# Altium project Back_Expansion_Base.PrjPcb
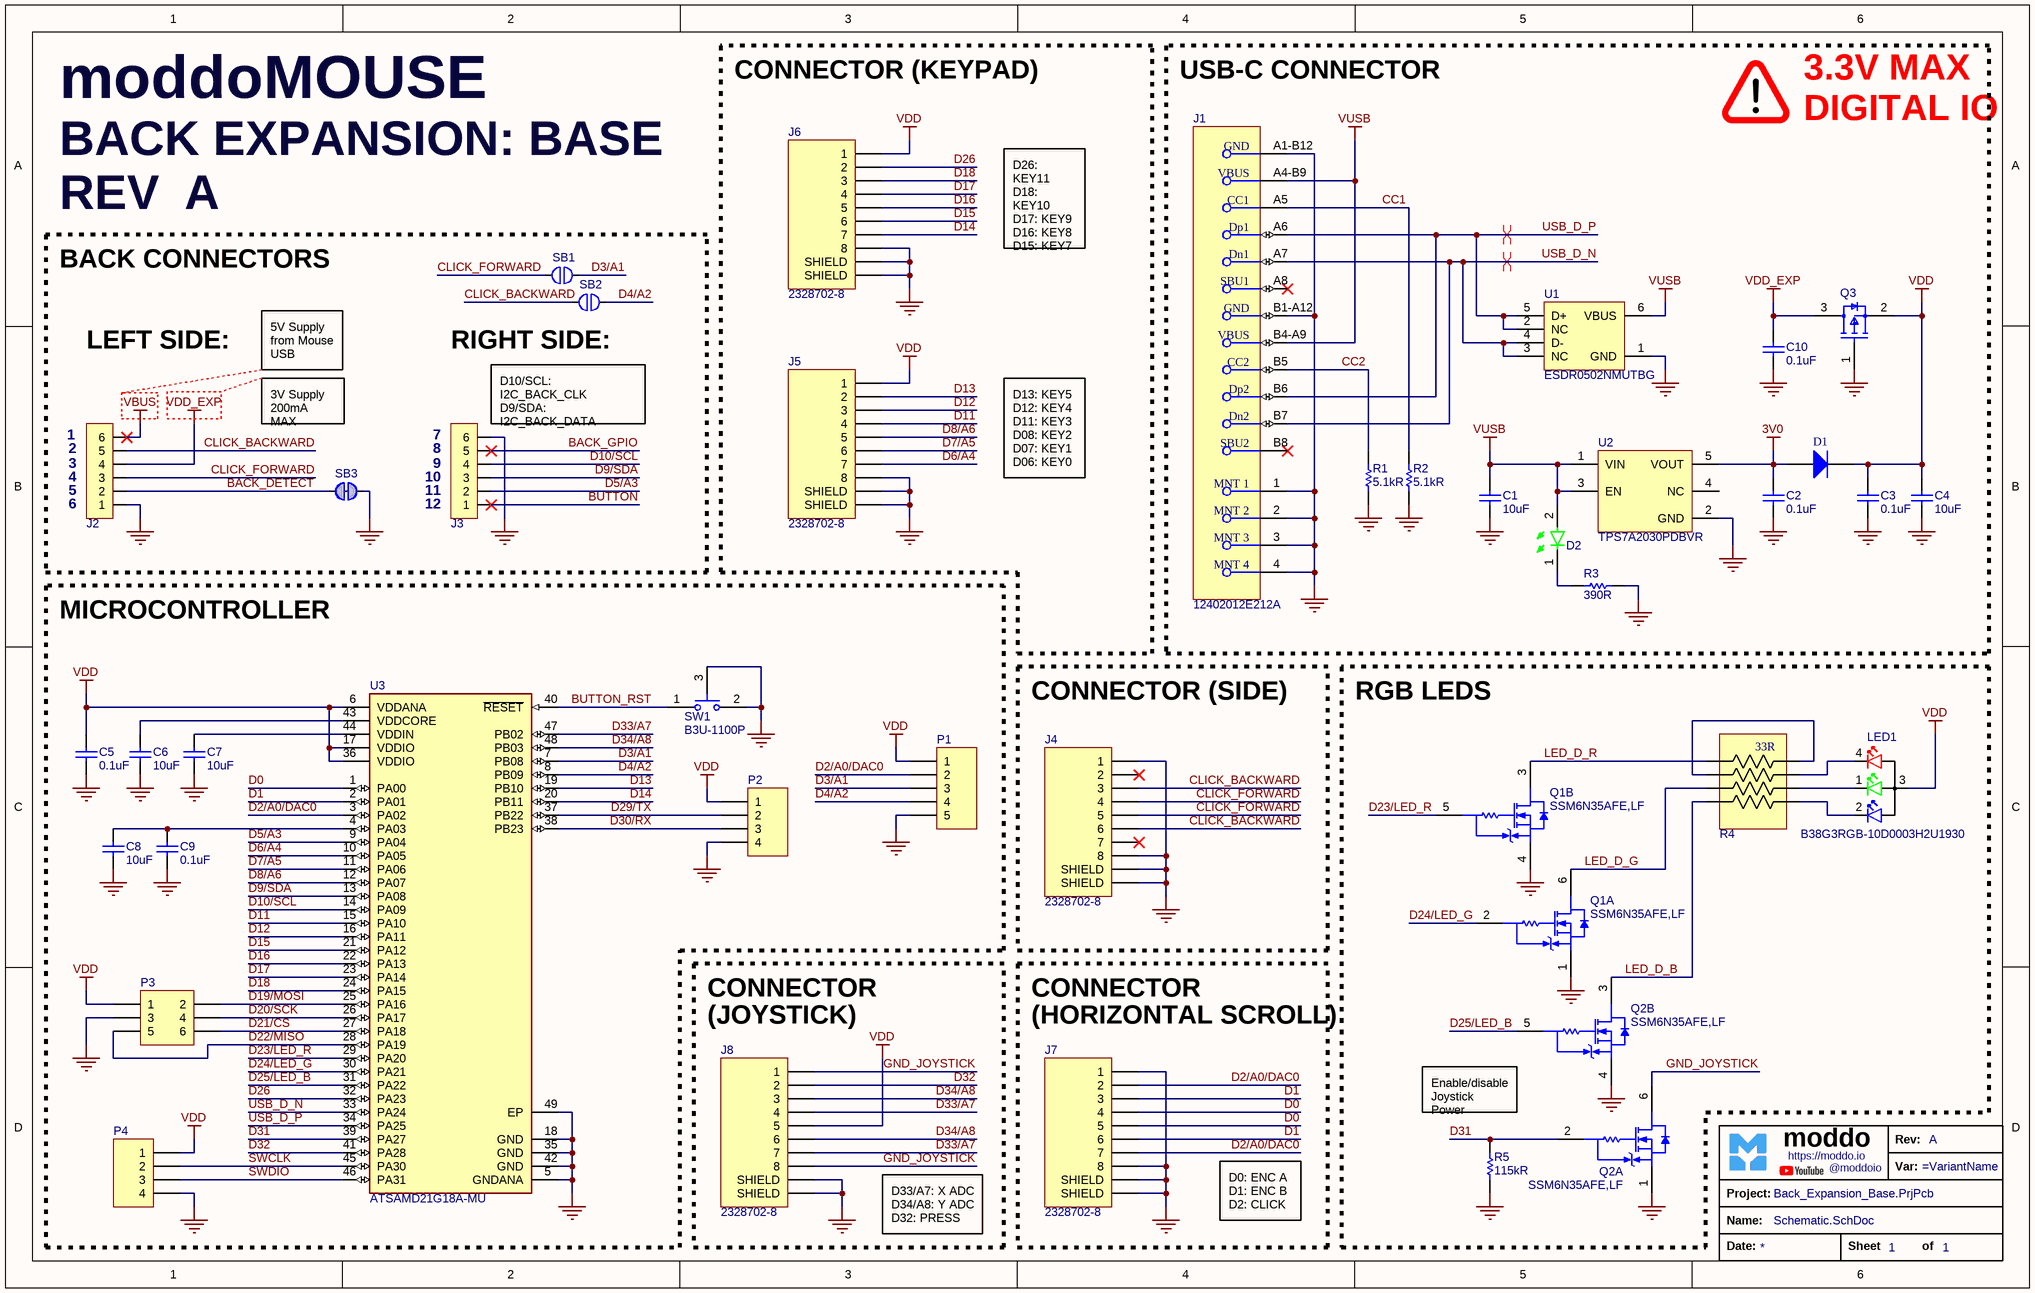
[diagram p0: Schematic.SchDoc]
Revision: A
1 sheet, 41 parts. Net scope: global (net labels, ports and power ports of the same name join across sheets).
Board files: PCB.PcbDoc, PcbPanel.PcbDoc

## Sheet Schematic.SchDoc
size B; SheetNumber: 1; SheetTotal: 1

### Parts
?  TitleBlock_moddo  (value not drawn)  (graphical)
C1  10uF  [C0603]
C2  0.1uF  [C0402]
C3  0.1uF  [C0402]
C4  10uF  [C0603]
C5  0.1uF  [C0402]
C6  10uF  [C0603]
C7  10uF  [C0603]
C8  10uF  [C0603]
C9  0.1uF  [C0402]
C10  0.1uF  [C0402]
D1  MMDL770T1G  [ONSC-SOD-323-2-477-02_V]  (value not drawn)
D2  LTST-C191KGKT  [LED0603_G]  (value not drawn)
J1  12402012E212A  [12402012E212A]
J2  1271WR-6P  [1.27mm_6pins_MaleHeader_RightAngle]  (value not drawn)
J3  1271WR-6P  [1.27mm_6pins_MaleHeader_RightAngle]  (value not drawn)
J4  2328702-8  [2328702-8]
J5  2328702-8  [2328702-8]
J6  2328702-8  [2328702-8]
J7  2328702-8  [2328702-8]
J8  2328702-8  [2328702-8]
LED1  B38G3RGB-10D0003H2U1930  [B38G3RGB-10D0003H2U1930]
P1  Header 5  [HDR1X5]  (value not drawn)
P2  Header 4  [HDR1X4]  (value not drawn)
P3  Header 3X2  [HDR2X3]  (value not drawn)
P4  Header 4  [HDR1X4]  (value not drawn)
Q1  SSM6N35AFE,LF  [SSM6N35AFE,LF]  (parts A,B of 2)
Q2  SSM6N35AFE,LF  [SSM6N35AFE,LF]  (parts A,B of 2)
Q3  IRLML6402TRPBF  [IRLML6402TRPBF]  (value not drawn)
R1  5.1kR  [R0402]
R2  5.1kR  [R0402]
R3  390R  [R1206]
R4  33R  [YC164-JR-0733RL]  (value not drawn)
R5  115kR  [R0402]
SB1  Solderbridge  [Solderbridge]  (value not drawn)  (no BOM)
SB2  Solderbridge  [Solderbridge]  (value not drawn)  (no BOM)
SB3  Solderbridge  [Solderbridge_Shorted]  (value not drawn)  (net tie, no BOM)
SW1  B3U-1100P  [FP-B3U-1100P-MFG]
U1  ESDR0502NMUTBG  [ESDR0502NMUTBG]
U2  TPS7A2030PDBVR  [TPS7A2030PDBVR]
U3  ATSAMD21G18A-MU  [FP-C04-21493-MFG]

### Blocks framed on the sheet
CONNECTOR (KEYPAD): J5 J6
REV: J2 J3 SB1-SB3
MICROCONTROLLER: C5-C9 P1-P4 SW1 U3
CONNECTOR (SIDE): J4
RGB LEDS: LED1 Q1 Q2 R4 R5

### Nets
3V0: C2.2 D1.2(A) U2.5(VOUT)
GND: C1.2 C2.1 C3.1 C4.2 C5.1 C6.2 C7.2 C8.2 C9.1 C10.1 J1.1(MNT_1) J1.2(MNT_2) J1.3(MNT_3) J1.4(MNT_4) J1.A1-B12(GND) J1.B1-A12(GND) J2.1 J3.6 J4.1 J4.8 J4.S1(SHIELD) J4.S2(SHIELD) J5.8 J5.S1(SHIELD) J5.S2(SHIELD) J6.8 J6.S1(SHIELD) J6.S2(SHIELD) J7.1 J7.8 J7.S1(SHIELD) J7.S2(SHIELD) J8.S1(SHIELD) J8.S2(SHIELD) P1.5 P2.4 P3.3 P4.4 Q1.1(S) Q1.4(S) Q2.1(S) Q2.4(S) Q3.1(G) R1.1 R2.1 R3.1 R5.2 SB3.1 SW1.2 SW1.3 U1.1(GND) U2.2(GND) U3.5(GNDANA) U3.18(GND) U3.35(GND) U3.42(GND) U3.49(EP)
VBUS: J2.6
VDD: C3.2 C4.1 C5.2 D1.1(K) J5.1 J6.1 J8.5 LED1.3(C) P1.1 P2.1 P3.1 P4.1 Q3.2(S) U3.6(VDDANA) U3.17(VDDIO) U3.36(VDDIO)
VDD_EXP: C10.2 J2.4 Q3.3(D)
VUSB: C1.1 D2.2(A) J1.A4-B9(VBUS) J1.B4-A9(VBUS) U1.6(VBUS) U2.1(VIN) U2.3(EN)
BACK_DETECT: J2.2 SB3.2
BACK_GPIO: J3.5
BUTTON: J3.1
BUTTON_RST: SW1.1 U3.40(~{RESET})
CC1: J1.A5(CC1) R2.2
CC2: J1.B5(CC2) R1.2
CLICK_BACKWARD: J2.5 J4.3 J4.6 SB2.2
CLICK_FORWARD: J2.3 J4.4 J4.5 SB1.2
D0: J7.4 J7.5 U3.1(PA00)
D1: J7.3 J7.6 U3.2(PA01)
D2/A0/DAC0: J7.2 J7.7 P1.2 U3.3(PA02)
D3/A1: P1.3 SB1.1 U3.7(PB08)
D4/A2: P1.4 SB2.1 U3.8(PB09)
D5/A3: J3.2 U3.9(PA04)
D6/A4: J5.7 U3.10(PA05)
D7/A5: J5.6 U3.11(PA06)
D8/A6: J5.5 U3.12(PA07)
D9/SDA: J3.3 U3.13(PA08)
D10/SCL: J3.4 U3.14(PA09)
D11: J5.4 U3.15(PA10)
D12: J5.3 U3.16(PA11)
D13: J5.2 U3.19(PB10)
D14: J6.7 U3.20(PB11)
D15: J6.6 U3.21(PA12)
D16: J6.5 U3.22(PA13)
D17: J6.4 U3.23(PA14)
D18: J6.3 U3.24(PA15)
D19/MOSI: P3.2 U3.25(PA16)
D20/SCK: P3.4 U3.26(PA17)
D21/CS: P3.6 U3.27(PA18)
D22/MISO: P3.5 U3.28(PA19)
D23/LED_R: Q1.5(G) U3.29(PA20)
D24/LED_G: Q1.2(G) U3.30(PA21)
D25/LED_B: Q2.5(G) U3.31(PA22)
D26: J6.2 U3.32(PA23)
D29/TX: P2.2 U3.37(PB22)
D30/RX: P2.3 U3.38(PB23)
D31: Q2.2(G) R5.1 U3.39(PA27)
D32: J8.2 U3.41(PA28)
D33/A7: J8.4 J8.7 U3.47(PB02)
D34/A8: J8.3 J8.6 U3.48(PB03)
GND_JOYSTICK: J8.1 J8.8 Q2.6(D)
LED_D_B: Q2.3(D) R4.4
LED_D_G: Q1.6(D) R4.3
LED_D_R: Q1.3(D) R4.1
SWCLK: P4.2 U3.45(PA30)
SWDIO: P4.3 U3.46(PA31)
USB_D_N: J1.A7(Dn1) J1.B7(Dn2) U1.3(NC) U1.4(D-) U3.33(PA24)
USB_D_P: J1.A6(Dp1) J1.B6(Dp2) U1.2(NC) U1.5(D+) U3.34(PA25)
NetC6_1: C6.1 U3.43(VDDCORE)
NetC7_1: C7.1 U3.44(VDDIN)
NetC8_1: C8.1 C9.2 U3.4(PA03)
NetD2_1: D2.1(C) R3.2
NetLED1_1: LED1.1(G) R4.6
NetLED1_2: LED1.2(B) R4.5
NetLED1_4: LED1.4(R) R4.7
NetR4_2: R4.2 R4.8

Not connected (* = marked no-connect by the designer): J1 A8(SBU1)* B8(SBU2)*; J4 2* 7*; U2 4(NC)

### Layout directives
differential pair: USB_D_N, USB_D_P

### Notes on the sheet
- USB-C CONNECTOR
- 3.3V MAX
- moddoMOUSE <https://moddo.io/>
- BACK EXPANSION: BASE <https://moddo.io/>
- DIGITAL IO
- BACK CONNECTORS
- D26: KEY11
  D18: KEY10
  D17: KEY9
  D16: KEY8
  D15: KEY7
  D14: KEY6
- LEFT SIDE:
- 5V Supply
  from Mouse USB
- (near SB2) RIGHT SIDE:
- 3V Supply
  200mA MAX
- (near J3) D10/SCL: I2C_BACK_CLK
  D9/SDA: I2C_BACK_DATA
  D5/A3: BACK_INT
- (near J2) 1
- (near J2) 2
- (near J2) 3
- (near J2) 4
- (near J2) 5
- (near J3) 7
- (near J3) 8
- (near J3) 9
- (near J3) 10
- (near J3) 11
- D13: KEY5
  D12: KEY4
  D11: KEY3
  D08: KEY2
  D07: KEY1
  D06: KEY0
- (near J2) 6
- (near J3) 12
- CONNECTOR
- (near J8) (JOYSTICK)
- (near J7) (HORIZONTAL SCROLL)
- Enable/disable Joystick Power
- D33/A7: X ADC
  D34/A8: Y ADC
  D32: PRESS
- D0: ENC A
  D1: ENC B
  D2: CLICK
- (in symbol TitleBlock_moddo) Rev:; moddo; https://moddo.io; Var:; @moddoio; Project:; Name:; Date:; Sheet; of

### Library data of the parts
C1 C4 C6-C8 = GRM188R61E106KA73D: 25V 10uF X5R ±10% 0603 Multilayer Ceramic Capacitors MLCC - SMD/SMT ROHS; Manufacturer: Murata; Manufacturer Lifecycle Status: IN PRODUCTION; Value: 10µF; Capacitance: 10uF; Supplier: Newark; Supplier Part Number: 92AH5110; Manufacturer Part Number: GRM188R61E106KA73D; RoHS: Compliant; Category: Ceramic Capacitors; Stock: 108000; Pricing: 4000=0.064, 8000=0.06, 16000=0.06, 24000=0.059 (CAD); Case/Package: 0603; Dielectric: X5R; Dielectric Material: Ceramic; Height: 800µm; Length: 1.6mm; Lifecycle Status: Production; Material: Ceramic; Max Operating Temperature: 85°C; Min Operating Temperature: -55°C; Mounting Technology: Surface Mount; Number of Terminals: 2; REACH SVHC: Yes; Schedule B: 8532240020, 8532240020|8532240020|8532240020|8532240020|8532240020; Thickness: 800µm; Tolerance: 10%; Voltage Rating: 25V; Voltage Rating (DC): 25V; Width: 800µm; ComponentLink1URL: https://datasheet.octopart.com:443/GRM188R61E106KA73D-Murata-datasheet-149523249.pdf?src-supplier=Newark; ComponentLink1Description: https://datasheet.octopart.com:443/GRM188R61E106KA73D-Murata-datasheet-149523249.pdf?src-supplier=Newark; ComponentLink2URL: https://datasheet.octopart.com:443/GRM188R61E106KA73D-Murata-datasheet-165579666.pdf?src-supplier=TME; ComponentLink2Description: https://datasheet.octopart.com:443/GRM188R61E106KA73D-Murata-datasheet-165579666.pdf?src-supplier=TME; ComponentLink3URL: https://datasheet.octopart.com:443/GRM188R61E106KA73D-Murata-datasheet-141274968.pdf?src-supplier=Ciiva; ComponentLink3Description: https://datasheet.octopart.com:443/GRM188R61E106KA73D-Murata-datasheet-141274968.pdf?src-supplier=Ciiva; ComponentLink4URL: https://datasheet.octopart.com:443/GRM188R61E106KA73D-Murata-datasheet-140704821.pdf?src-supplier=Ciiva; ComponentLink4Description: https://datasheet.octopart.com:443/GRM188R61E106KA73D-Murata-datasheet-140704821.pdf?src-supplier=Ciiva; ComponentLink5URL: https://datasheet.octopart.com:443/GRM188R61E106KA73D-Murata-datasheet-138742889.pdf?src-supplier=Ciiva; ComponentLink5Description: https://datasheet.octopart.com:443/GRM188R61E106KA73D-Murata-datasheet-138742889.pdf?src-supplier=Ciiva; ComponentLink6URL: https://datasheet.octopart.com/GRM188R61E106KA73D-Murata-datasheet-12515295.pdf; ComponentLink6Description: https://datasheet.octopart.com/GRM188R61E106KA73D-Murata-datasheet-12515295.pdf; ComponentLink7URL: https://datasheet.octopart.com/GRM188R61E106KA73D-Murata-datasheet-12510076.pdf; ComponentLink7Description: https://datasheet.octopart.com/GRM188R61E106KA73D-Murata-datasheet-12510076.pdf; ComponentLink8URL: https://datasheet.octopart.com/GRM188R61E106KA73D-Murata-datasheet-11978611.pdf; ComponentLink8Description: https://datasheet.octopart.com/GRM188R61E106KA73D-Murata-datasheet-11978611.pdf; ComponentLink9URL: https://datasheet.octopart.com/GRM188R61E106KA73D-Murata-datasheet-10025737.pdf; ComponentLink9Description: https://datasheet.octopart.com/GRM188R61E106KA73D-Murata-datasheet-10025737.pdf; ComponentLink10URL: https://datasheet.octopart.com/GRM188R61E106KA73D-Murata-datasheet-8819587.pdf; ComponentLink10Description: https://datasheet.octopart.com/GRM188R61E106KA73D-Murata-datasheet-8819587.pdf; ComponentLink11URL: http://sigma.octopart.com:80/reach_statement/Murata-company-16.pdf?src-supplier=Compliance+Statements; ComponentLink11Description: http://sigma.octopart.com:80/reach_statement/Murata-company-16.pdf?src-supplier=Compliance+Statements
C2 C3 C5 C9 C10 = CL05B104KA5NNNC: 25V 100nF X7R ±10% 0402 Multilayer Ceramic Capacitors MLCC - SMD/SMT ROHS; Manufacturer: Samsung Electro-Mechanics; Supplier 1: DigiKey; Manufacturer Part Number: CL05B104KA5NNNC; RoHS: Compliant; Category: Ceramic Capacitors; Stock 1: 1082110; Pricing 1: 1=0.08, 10=0.004, 50=0.0036, 100=0.0032 (USD); Value: 0.1uF; Case/Package: 0402; Case Code (Imperial): 0402; Case Code (Metric): 1005; China RoHS: Compliant; Dielectric: X7R; Dielectric Material: Ceramic; Height: 500µm; Length: 1mm; Lifecycle Status: Production; Material: Ceramic; Max Operating Temperature: 125°C; Min Operating Temperature: -55°C; Mounting Technology: Surface Mount; Number of Terminals: 2; REACH SVHC: Yes; Schedule B: 8532240020, 8532240020|8532240020|8532240020|8532240020|8532240020|8532240020|8532240020|8532240020|8532240020|8532240020|8532240020|8532240020|8532240020|8532240020|8532240020|8532240020|8532240020|8532240020|8532240020|8532240020|8532240020|8532240020|8532240020|85; Thickness: 558.8µm; Tolerance: 10%; Voltage Rating: 25V; Voltage Rating (DC): 25V; Width: 500µm; ComponentLink1URL: https://datasheet.octopart.com:443/CL05B104KA5NNNC-Samsung-Electro-Mechanics-datasheet-136876160.pdf?src-supplier=Samsung+SCT; ComponentLink1Description: https://datasheet.octopart.com:443/CL05B104KA5NNNC-Samsung-Electro-Mechanics-datasheet-136876160.pdf?src-supplier=Samsung+SCT; ComponentLink2URL: https://datasheet.octopart.com:443/CL05B104KA5NNNC-Samsung-Electro-Mechanics-datasheet-116890910.pdf?src-supplier=Future+Electronics; ComponentLink2Description: https://datasheet.octopart.com:443/CL05B104KA5NNNC-Samsung-Electro-Mechanics-datasheet-116890910.pdf?src-supplier=Future+Electronics; ComponentLink3URL: https://datasheet.octopart.com:443/CL05B104KA5NNNC-Samsung-Electro-Mechanics-datasheet-104201047.pdf?src-supplier=Future+Electronics; ComponentLink3Description: https://datasheet.octopart.com:443/CL05B104KA5NNNC-Samsung-Electro-Mechanics-datasheet-104201047.pdf?src-supplier=Future+Electronics; ComponentLink4URL: https://datasheet.octopart.com:443/CL05B104KA5NNNC-Samsung-Electro-Mechanics-datasheet-148801811.pdf?src-supplier=Future+Electronics; ComponentLink4Description: https://datasheet.octopart.com:443/CL05B104KA5NNNC-Samsung-Electro-Mechanics-datasheet-148801811.pdf?src-supplier=Future+Electronics; ComponentLink5URL: https://datasheet.octopart.com/CL05B104KA5NNNC-Samsung-Electro-Mechanics-datasheet-97040617.pdf; ComponentLink5Description: https://datasheet.octopart.com/CL05B104KA5NNNC-Samsung-Electro-Mechanics-datasheet-97040617.pdf; ComponentLink6URL: https://datasheet.octopart.com/CL05B104KA5NNNC-Samsung-Electro-Mechanics-datasheet-8324245.pdf; ComponentLink6Description: https://datasheet.octopart.com/CL05B104KA5NNNC-Samsung-Electro-Mechanics-datasheet-8324245.pdf; ComponentLink7URL: https://datasheet.octopart.com:443/CL05B104KA5NNNC-Samsung-datasheet-8326407.pdf?src-supplier=TME; ComponentLink7Description: https://datasheet.octopart.com:443/CL05B104KA5NNNC-Samsung-datasheet-8326407.pdf?src-supplier=TME; Supplier Part Number 1: 1276-6720-1-ND; Capacitance: 0.1uF
D1 = MMDL770T1G: Schottky Barrier Diode, 2-Pin SOD-323, Pb-Free, Tape and Reel; Manufacturer: On Semiconductor; Manufacturer Lifecycle Status: ACTIVE; Configuration: Single; Current Rating: 100mA; Forward Current: 10mA; Forward Voltage: 1V; Max Power Dissipation: 200mW; Max Repetitive Reverse Voltage (Vrrm): 70V; Max Reverse Leakage Current: 200nA; Number of Elements: 1; ComponentLink2URL: http://www.onsemi.cn/pub_link/Collateral/MMDL770T1-D.PDF; DatasheetVersion: Rev. 3; PartNumber: MMDL770T1G; ComponentLink3Description: Package Specification; ComponentLink2Description: Datasheet; Mounting Technology: Surface Mount; ComponentLink1Description: Manufacturer URL; PackageDescription: 2-Pin SOD, Body 1.7 x 1.25 mm; ComponentLink3URL: http://www.onsemi.com/pub_link/Collateral/477-02.PDF.1; PackageReference: SOD-323-2-477-02; ComponentLink1URL: http://www.onsemi.com/; RoHS: TRUE; Packing: Tape and Reel; PackageVersion: Rev. H, 03/2007; Supplier: Avnet; Supplier Part Number: 26K4556; Manufacturer Part Number: MMDL770T1G; Category: Schottky Diodes; Stock: 5789; Pricing: 1=0.11, 25=0.054, 50=0.051, 100=0.047 (USD); Case/Package: SOD-323-2; China RoHS: Compliant; Country of Origin: Mainland China; Export Control Classification Number (ECCN) Code: EAR99; Element Configuration: Single; Height: 1mm; Harmonized Tariff Schedule (HTS) Code: 8541.10.00.60; Introduction Date: 2000-01-01; Lead Free: Lead Free; Length: 1.8mm; Lifecycle Status: Production; Max Operating Temperature: 150°C; Max Reverse Voltage (DC): 70V; Min Operating Temperature: -55°C; Pins: 2; Number of Terminals: 2; Output Current: 100mA; Packaging: Tape and Reel; Peak Reverse Current: 200nA; Power Dissipation: 200mW; Radiation Hardening: No; REACH SVHC: Yes; Reverse Standoff Voltage: 70V; Schedule B: 8541100050, 8541100050|8541100050, 8541100050|8541100050|8541100050, 8541100050|8541100050|8541100050|8541100050; Voltage Rating (DC): 70V; Width: 1.35mm; ComponentLink4URL: https://datasheet.octopart.com:443/MMDL770T1G-onsemi-datasheet-180963709.pdf?src-supplier=IHS; ComponentLink4Description: https://datasheet.octopart.com:443/MMDL770T1G-onsemi-datasheet-180963709.pdf?src-supplier=IHS; ComponentLink5URL: https://datasheet.octopart.com:443/MMDL770T1G-ON-Semiconductor-datasheet-36854408.pdf?src-supplier=element14+APAC; ComponentLink5Description: https://datasheet.octopart.com:443/MMDL770T1G-ON-Semiconductor-datasheet-36854408.pdf?src-supplier=element14+APAC; ComponentLink6URL: https://datasheet.octopart.com:443/MMDL770T1G-ON-Semiconductor-datasheet-5319181.pdf?src-supplier=onsemi; ComponentLink6Description: https://datasheet.octopart.com:443/MMDL770T1G-ON-Semiconductor-datasheet-5319181.pdf?src-supplier=onsemi; ComponentLink7URL: https://datasheet.octopart.com:443/MMDL770T1G-onsemi-datasheet-182017838.pdf?src-supplier=Farnell; ComponentLink7Description: https://datasheet.octopart.com:443/MMDL770T1G-onsemi-datasheet-182017838.pdf?src-supplier=Farnell; ComponentLink8URL: https://datasheet.octopart.com:443/MMDL770T1G-onsemi-datasheet-12512631.pdf?src-supplier=Electro+Sonic; ComponentLink8Description: https://datasheet.octopart.com:443/MMDL770T1G-onsemi-datasheet-12512631.pdf?src-supplier=Electro+Sonic; ComponentLink9URL: https://datasheet.octopart.com:443/MMDL770T1G-ON-Semiconductor-datasheet-14055236.pdf?src-supplier=iiiC; ComponentLink9Description: https://datasheet.octopart.com:443/MMDL770T1G-ON-Semiconductor-datasheet-14055236.pdf?src-supplier=iiiC; ComponentLink10URL: http://sigma.octopart.com:80/150618769/rohs_statement/ON-Semiconductor-MMDL770T1G.pdf?src-supplier=Compliance+Statements; ComponentLink10Description: http://sigma.octopart.com:80/150618769/rohs_statement/ON-Semiconductor-MMDL770T1G.pdf?src-supplier=Compliance+Statements; ComponentLink11URL: http://sigma.octopart.com:80/reach_statement/ON-Semiconductor-company-79.pdf?src-supplier=Compliance+Statements; ComponentLink11Description: http://sigma.octopart.com:80/reach_statement/ON-Semiconductor-company-79.pdf?src-supplier=Compliance+Statements; ComponentLink12URL: https://octopart.com:443/opatz8j6/c1?t=rGUbnPQX5GDmqEoGA-uR9SMXeEE7gORXoUpQk9tSLLSbDH3jegWqyoKxn1aLDysZ9F5UsAZS4pPStALKuwhJs2fCT0RUcZefN4YW3NRJTnKxS4A-_hdC7myPNVw6LMAUwIC-S9tezZfVA4A1ydwTwICm1Zig62LOizv3-I4cESK-S3z73XMi6jENgAwvT9WW2Ujns6vlfkFPR1ge60eOsdw7mCv_eawZuRnDiCvhTwxevApDMfItvTsY4qOoFIyWXnC3xRoUEF-kP7l_SrDrtqPP9kRW2I59JGoGtbuF7U1X9Kz7fF6DLUUU8OKOHaq00oGLbmB3QQR_ilBlaPwbBtyCq9UFUCFQV3Lx&src-supplier=Compliance+Statements; ComponentLink12Description: https://octopart.com:443/opatz8j6/c1?t=rGUbnPQX5GDmqEoGA-uR9SMXeEE7gORXoUpQk9tSLLSbDH3jegWqyoKxn1aLDysZ9F5UsAZS4pPStALKuwhJs2fCT0RUcZefN4YW3NRJTnKxS4A-_hdC7myPNVw6LMAUwIC-S9tezZfVA4A1ydwTwICm1Zig62LOizv3-I4cESK-S3z73XMi6jENgAwvT9WW2Ujns6vlfkFPR1ge60eOsdw7mCv_eawZuRnDiCvhTwxevApDMfItvTsY4qOoFIyWXnC3xRoUEF-kP7l_SrDrtqPP9kRW2I59JGoGtbuF7U1X9Kz7fF6DLUUU8OKOHaq00oGLbmB3QQR_ilBlaPwbBtyCq9UFUCFQV3Lx&src-supplier=Compliance+Statements; ComponentLink13URL: https://octopart.com:443/opatz8j6/c1?t=xWlJBbSOjuihLu5tuYbHtsOtU_1QEHMfXja7QzQLZunojekw5uNnIM6cdSsnrAiuel8TWOmyDr2oU2k5holZexZGehk33AL-VJp_F-YhdfFYCHMkiSGbs39G6IHVRAjVdbrrjoHKUeBgpuPxzOORf6r5STdjFqtSwLT9Nq4Bz44wz_CIS2ZBWUVn7GkwGD0qpIrqRgfjV-NMFfhaHRoet9F-4YHZTFqxnCOCPSqoXpX2X76YlNkd9rQHSxjoEhR65VTyaE62P0vZksiIy9_tvP3cuZ7OKmIIlGt_ji7T3rxylmYploIrt9FpCqpYCsF1M5B6QleRuxMliCf8adPp1S-NqaPXrK-rp0vGQA&src-supplier=Compliance+Statements; ComponentLink13Description: https://octopart.com:443/opatz8j6/c1?t=xWlJBbSOjuihLu5tuYbHtsOtU_1QEHMfXja7QzQLZunojekw5uNnIM6cdSsnrAiuel8TWOmyDr2oU2k5holZexZGehk33AL-VJp_F-YhdfFYCHMkiSGbs39G6IHVRAjVdbrrjoHKUeBgpuPxzOORf6r5STdjFqtSwLT9Nq4Bz44wz_CIS2ZBWUVn7GkwGD0qpIrqRgfjV-NMFfhaHRoet9F-4YHZTFqxnCOCPSqoXpX2X76YlNkd9rQHSxjoEhR65VTyaE62P0vZksiIy9_tvP3cuZ7OKmIIlGt_ji7T3rxylmYploIrt9FpCqpYCsF1M5B6QleRuxMliCf8adPp1S-NqaPXrK-rp0vGQA&src-supplier=Compliance+Statements
D2 = LTST-C191KGKT: Single Color LED, Ultra Bright Green, Water Clear, 1.1mm; Manufacturer: Lite-On; Dominant Wavelength: 571nm; Forward Current: 30mA; Forward Voltage: 2.4V; Lens Color: Clear, Colorless; Luminous Intensity: 18mcd; Number of Circuits: 1; Peak Wavelength: 574nm; Power Dissipation: 75mW; Reverse Voltage: 5V; Shape: Rectangular; Test Current: 20mA; Viewing Angle: 130°; Wavelength: 576.5nm; Supplier: DigiKey; Supplier Part Number: 160-1446-1-ND; Manufacturer Part Number: LTST-C191KGKT; RoHS: Compliant; Category: LEDs; Stock: 2683248; Pricing: 1=0.15, 10=0.1, 100=0.0688, 500=0.05448, 1000=0.04972, 2000=0.04564, 5000=0.04116, 10000=0.03835, 15000=0.0369, 25000=0.03527, 35000=0.03429, 50000=0.03334, 125000=0.03124, 250000=0.02993 (USD); Case/Package: 0603; Case Code (Imperial): 0603; Case Code (Metric): 1608; China RoHS: Compliant; Color: Green; Contact Plating: Tin; Depth: 800µm; Height: 550µm; Illumination Color: Green; Lead Free: Lead Free; Length: 1.6mm; Lens Style: Clear; Lens Transparency: Clear; Lifecycle Status: Production; Max Operating Temperature: 85°C; Min Operating Temperature: -55°C; Mounting Technology: Surface Mount; Number of Elements: 1; Number of LEDs: 1; Pins: 2; Number of Terminals: 2; Power Rating: 75mW; Radiation Hardening: No; REACH SVHC: Yes; Schedule B: 8541402000, 8541402000|8541402000|8541402000|8541402000|8541402000; Terminal Pitch: 1.5mm; Width: 800µm; ComponentLink1URL: https://datasheet.octopart.com:443/LTST-C191KGKT-Lite-On-datasheet-86397321.pdf?src-supplier=Electro+Sonic; ComponentLink1Description: https://datasheet.octopart.com:443/LTST-C191KGKT-Lite-On-datasheet-86397321.pdf?src-supplier=Electro+Sonic; ComponentLink2URL: https://datasheet.octopart.com:443/LTST-C191KGKT-Lite-On-datasheet-180605192.pdf?src-supplier=IHS; ComponentLink2Description: https://datasheet.octopart.com:443/LTST-C191KGKT-Lite-On-datasheet-180605192.pdf?src-supplier=IHS; ComponentLink3URL: https://datasheet.octopart.com:443/LTST-C191KGKT-Lite-On-datasheet-159358.pdf?src-supplier=_legacy+Avnet; ComponentLink3Description: https://datasheet.octopart.com:443/LTST-C191KGKT-Lite-On-datasheet-159358.pdf?src-supplier=_legacy+Avnet; ComponentLink4URL: https://datasheet.octopart.com:443/LTST-C191KGKT-Lite-On-datasheet-165573808.pdf?src-supplier=TME; ComponentLink4Description: https://datasheet.octopart.com:443/LTST-C191KGKT-Lite-On-datasheet-165573808.pdf?src-supplier=TME; ComponentLink5URL: https://datasheet.octopart.com:443/LTST-C191KGKT-Lite-On-datasheet-43775822.pdf?src-supplier=TME; ComponentLink5Description: https://datasheet.octopart.com:443/LTST-C191KGKT-Lite-On-datasheet-43775822.pdf?src-supplier=TME; ComponentLink6URL: https://datasheet.octopart.com:443/LTST-C191KGKT-Lite-On-datasheet-32047002.pdf?src-supplier=Future+Electronics; ComponentLink6Description: https://datasheet.octopart.com:443/LTST-C191KGKT-Lite-On-datasheet-32047002.pdf?src-supplier=Future+Electronics; ComponentLink7URL: https://datasheet.octopart.com:443/LTST-C191KGKT-Lite-On-datasheet-65361.pdf?src-supplier=DigiKey; ComponentLink7Description: https://datasheet.octopart.com:443/LTST-C191KGKT-Lite-On-datasheet-65361.pdf?src-supplier=DigiKey
J1 = 12402012E212A: USB Connector, USB Type C, USB 2.0, Receptacle, 24 Ways, Surface Mount, Through Hole Mount; Manufacturer: Amphenol; Contact Resistance: 40mΩ; Current Rating: 5A; Insulation Resistance: 100MΩ; Number of Ports: 1; Supplier 1: Newark; Manufacturer Part Number: 12402012E212A; RoHS: Compliant; Category: Connectors; Stock 1: 4800; Pricing 1: 800=0.723, 1600=0.716, 3200=0.702, 4800=0.686, 8000=0.675 (CAD); Contact Gender: Male; Lifecycle Status: Production; Pins: 24; Number of Rows: 1; REACH SVHC: Yes; Shell Finish: Nickel; Shell Material: Stainless Steel; Terminal Pitch: 500µm; ComponentLink1URL: https://datasheet.octopart.com:443/12402012E212A-Amphenol-Communications-Solutions-datasheet-182242347.pdf?src-supplier=IHS; ComponentLink1Description: https://datasheet.octopart.com:443/12402012E212A-Amphenol-Communications-Solutions-datasheet-182242347.pdf?src-supplier=IHS; Supplier Part Number 1: 29AK9975
J2 J3 = 1.27mm_6pins_male_rightangle: Pin Header 6 Position 1.27mm Pitch Single Row Through Hole, Right Angle -40℃~+105℃; Manufacturer: HanElectricity; Manufacturer Part Number: 1271WR-6P
J4-J8 = 2328702-8: FFC/FPC Connector, 8 Contact(s), 1 Row(s), Right Angle, Solder Terminal, Natural Insulator; Manufacturer: TE Connectivity; Actuator Material: Thermoplastic; Actuator Color: Black; Plating: Gold; Number of Positions: 8; Voltage Rating: 50V; Connector System: Wire-to-Board; Gender: Receptacle; Sealable: No (Without); Supplier 1: Arrow Electronics; Manufacturer Part Number: 2328702-8; RoHS: Yes; Category: FFC / FPC; Stock 1: 56000; Pricing 1: 28000=0.0961 (USD); Mounting Technology: Surface Mount; Contact Material: Copper Alloy; Contact Plating: Gold; Housing Material: Thermoplastic; Housing Color: Natural; Min Operating Temperature: -40°C; Max Operating Temperature: 85°C; Packaging: Cut Tape; Termination: Solder; Series: -; Number of Contacts: 8; Number of Rows: 1; Operating Supply Voltage: 50V; Orientation: Right Angle; Length: 6mm; Height: 1mm; Flammability Rating: UL94 V-0; ComponentLink1URL: https://www.te.com/commerce/DocumentDelivery/DDEController?Action=srchrtrv&amp;DocNm=2328702&amp;DocType=Customer+Drawing&amp;DocLang=English&src-supplier=Digikey; ComponentLink1Description: https://www.te.com/commerce/DocumentDelivery/DDEController?Action=srchrtrv&amp;DocNm=2328702&amp;DocType=Customer+Drawing&amp;DocLang=English&src-supplier=Digikey; Supplier Part Number 1: 2328702-8
LED1 = B38G3RGB-10D0003H2U1930: Led Rgb Mixed White ( 1.6(L)X1.6; Manufacturer: Inolux; Supplier 1: Arrow Electronics; Manufacturer Part Number: B38G3RGB-10D0003H2U1930; RoHS: No; Supplier Part Number 1: B38G3RGB-10D0003H2U1930
P1 = Header 5: Header, 5-Pin; LatestRevisionDate: 17-Jul-2002; LatestRevisionNote: Re-released for DXP Platform.; Publisher: Altium Limited; Manufacturer: N/A; Manufacturer Part Number: N/A
P2 P4 = Header 4: Header, 4-Pin; LatestRevisionDate: 17-Jul-2002; LatestRevisionNote: Re-released for DXP Platform.; Publisher: Altium Limited; Manufacturer: N/A; Manufacturer Part Number: N/A
P3 = Header 3X2: Header, 3-Pin, Dual row; LatestRevisionDate: 17-Jul-2002; LatestRevisionNote: Re-released for DXP Platform.; Publisher: Altium Limited; Manufacturer: N/A; Manufacturer Part Number: N/A
Q1 Q2 = SSM6N35AFE,LF: Small Low ON Resistance MOSFET Array Dual N-Channel 20V 250mA 6-Pin SOT-563 T/R; Manufacturer: Toshiba; Supplier 1: Mouser; Manufacturer Part Number: SSM6N35AFE,LF; RoHS: No; Category: MOSFETs; Stock 1: 156554; Pricing 1: 1=0.14, 10=0.08, 50=0.08, 100=0.067, 1000=0.058, 10000=0.045 (USD); ComponentLink1URL: https://toshiba.semicon-storage.com/info/docget.jsp?did=55422&prodName=SSM6N35AFE&src-supplier=Digikey; ComponentLink1Description: https://toshiba.semicon-storage.com/info/docget.jsp?did=55422&prodName=SSM6N35AFE&src-supplier=Digikey; Supplier Part Number 1: 757-SSM6N35AFELF
Q3 = IRLML6402TRPBF: MOSFET P-CH 20V 3.7A SOT-23; Manufacturer: Infineon; Reverse Recovery Time: 29ns; Max Forward Diode Voltage: -1.2V; Input Capacitace At Vds: 633pF @ -10V; Drain To Source Resistance: 0.05Ω; Gate To Source Voltage: 12V; Max Junction Temp: +150°C; Pulse Drain Current: -22A; Threshold Vgs Min: -0.4V; Turn Off Delay Time: 588ns; Number Of Channels: 1; Power Dissipation: 1.3W; Turn On Delay Time: 350ns; Drain To Source Breakdown Voltage: -20V; Continuous Drain Current: -3.7A; Depletion Mode: False; Gate Charge At Vgs: 8nC @ -5V; Rthja Max: 75°C/W; Threshold Vgs: -0.55V; Standoff Height: 0.01mm; Reverse Recovery Charge: 11nC; Device Class L2: Transistors; Ipc Land Pattern Name: SOT95P237X100-3; Temperature Range High: +150°C; Octopart: https://octopart.com/irlml6402trpbf-infineon-65874989; ComponentLink2URL: https://www.infineon.com/dgdl/irlml6402pbf.pdf?fileId=5546d462533600a401535668d5c2263c; Automotive: No; Manufacturer Part Number: IRLML6402TRPBF; Height: 1.12mm; Drain To Source Voltage: -20V; Digikey Description: MOSFET P-CH 20V 3.7A SOT-23; Device Class L1: Discrete Semiconductors; Package: Micro3; Lead Free: Yes; Temperature Range Low: -55°C; Number Of P Channels: 1; Technology: MOSFET; Temperature: -55°C to +150°C; Category: Trans; Footprint Url: http://irf.com/package/outline/po_micro3.pdf; RoHS: TRUE; Device Class L3: MOSFETs; Threshold Vgs Max: -1.2V; ComponentLink2Description: Datasheet
R1 R2 = RC0402FR-075K1L: 62.5mW Thick Film Resistors 50V ±100ppm/℃ ±1% 5.1kΩ 0402 Chip Resistor - Surface Mount ROHS; Manufacturer: Yageo Group; Max Power Dissipation: 63mW; Temperature Coefficient: 100ppm/°C; Resistance: 5.1kR; Supplier 1: Avnet; Manufacturer Part Number: RC0402FR-075K1L; RoHS: Compliant; Category: Chip SMD Resistors; Stock 1: 140000; Pricing 1: 10000=0.00097, 20000=0.00093, 40000=0.0009, 60000=0.00087, 80000=0.00084 (USD); Case/Package: 0402; Case Code (Imperial): 0402; China RoHS: Non-Compliant; Composition: Thick Film; Depth: 500µm; Features: Moisture Resistant; Height: 350µm; Lead Free: Lead Free; Length: 1mm; Lifecycle Status: Production; Max Operating Temperature: 155°C; Military Standard: Not; Min Operating Temperature: -55°C; Mounting Technology: Surface Mount; Pins: 2; Number of Terminals: 2; Number of Terminations: 2; Packaging: Cut Tape; Power Dissipation: 62.5mW; Power Rating: 63mW; REACH SVHC: Yes; Value: 5.1kΩ; Schedule B: 8533210045, 8533210045|8533210045, 8533210045|8533210045|8533210045, 8533210045|8533210045|8533210045|8533210045; Termination: SMD/SMT; Tolerance: 1%; Voltage Rating: 50V; Voltage Rating (DC): 50V; Width: 500µm; Working Voltage: 50V; ComponentLink1URL: https://datasheet.octopart.com:443/RC0402FR-075K1L-Yageo-datasheet-175887523.pdf?src-supplier=IHS; ComponentLink1Description: https://datasheet.octopart.com:443/RC0402FR-075K1L-Yageo-datasheet-175887523.pdf?src-supplier=IHS; ComponentLink2URL: https://datasheet.octopart.com:443/RC0402FR-075K1L-Yageo-datasheet-103092701.pdf?src-supplier=Upverter; ComponentLink2Description: https://datasheet.octopart.com:443/RC0402FR-075K1L-Yageo-datasheet-103092701.pdf?src-supplier=Upverter; ComponentLink3URL: https://datasheet.octopart.com:443/RC0402FR-075K1L-Yageo-datasheet-10408619.pdf?src-supplier=Newark; ComponentLink3Description: https://datasheet.octopart.com:443/RC0402FR-075K1L-Yageo-datasheet-10408619.pdf?src-supplier=Newark; ComponentLink4URL: https://datasheet.octopart.com:443/RC0402FR-075K1L-Yageo-datasheet-8324527.pdf?src-supplier=Newark; ComponentLink4Description: https://datasheet.octopart.com:443/RC0402FR-075K1L-Yageo-datasheet-8324527.pdf?src-supplier=Newark; ComponentLink5URL: https://datasheet.octopart.com:443/RC0402FR-075K1L-Yageo-datasheet-62067350.pdf?src-supplier=element14+APAC; ComponentLink5Description: https://datasheet.octopart.com:443/RC0402FR-075K1L-Yageo-datasheet-62067350.pdf?src-supplier=element14+APAC; ComponentLink6URL: https://datasheet.octopart.com:443/RC0402FR-075K1L-Yageo-datasheet-164759695.pdf?src-supplier=Future+Electronics; ComponentLink6Description: https://datasheet.octopart.com:443/RC0402FR-075K1L-Yageo-datasheet-164759695.pdf?src-supplier=Future+Electronics; ComponentLink7URL: https://datasheet.octopart.com:443/RC0402FR-075K1L-Yageo-datasheet-137700087.pdf?src-supplier=Future+Electronics; ComponentLink7Description: https://datasheet.octopart.com:443/RC0402FR-075K1L-Yageo-datasheet-137700087.pdf?src-supplier=Future+Electronics; ComponentLink8URL: https://datasheet.octopart.com:443/RC0402FR-075K1L-Yageo-datasheet-12531192.pdf?src-supplier=Future+Electronics; ComponentLink8Description: https://datasheet.octopart.com:443/RC0402FR-075K1L-Yageo-datasheet-12531192.pdf?src-supplier=Future+Electronics; ComponentLink9URL: https://datasheet.octopart.com:443/RC0402FR-075K1L-Yageo-datasheet-505231.pdf?src-supplier=Future+Electronics; ComponentLink9Description: https://datasheet.octopart.com:443/RC0402FR-075K1L-Yageo-datasheet-505231.pdf?src-supplier=Future+Electronics; ComponentLink10URL: https://datasheet.octopart.com:443/RC0402FR-075K1L-Yageo-datasheet-148775077.pdf?src-supplier=TME; ComponentLink10Description: https://datasheet.octopart.com:443/RC0402FR-075K1L-Yageo-datasheet-148775077.pdf?src-supplier=TME; ComponentLink11URL: https://datasheet.octopart.com/RC0402FR-075K1L-Yageo-datasheet-73766026.pdf; ComponentLink11Description: https://datasheet.octopart.com/RC0402FR-075K1L-Yageo-datasheet-73766026.pdf; ComponentLink12URL: https://datasheet.octopart.com:443/RC0402FR-075K1L-Yageo-datasheet-8329306.pdf?src-supplier=element14; ComponentLink12Description: https://datasheet.octopart.com:443/RC0402FR-075K1L-Yageo-datasheet-8329306.pdf?src-supplier=element14; ComponentLink13URL: http://sigma.octopart.com:80/rohs_statement/Yageo-company-2.pdf?src-supplier=Compliance+Statements; ComponentLink13Description: http://sigma.octopart.com:80/rohs_statement/Yageo-company-2.pdf?src-supplier=Compliance+Statements; ComponentLink14URL: http://sigma.octopart.com:80/conflict_mineral_statement/Yageo-company-3.pdf?src-supplier=Compliance+Statements; ComponentLink14Description: http://sigma.octopart.com:80/conflict_mineral_statement/Yageo-company-3.pdf?src-supplier=Compliance+Statements; Supplier Part Number 1: RC0402FR-075K1L
R3 = CRCW1206390RFKEAHP: Res Thick Film 1206 390 Ohm 1% 0.75W(3/4W) ±100ppm/°C Pad SMD Automotive T/R; Manufacturer: Vishay; Power Rating: 500mW; Voltage Rating: 200V; Supplier 1: Mouser; Manufacturer Part Number: CRCW1206390RFKEAHP; RoHS: Yes; Category: Chip SMD Resistors; Stock 1: 1207; Pricing 1: 1=0.32, 10=0.115, 50=0.115, 100=0.073, 1000=0.058, 10000=0.044 (USD); Case/Package: 1206; Case Code (Metric): 3216; Case Code (Imperial): 1206; Contact Plating: Tin; Min Operating Temperature: -55°C; Max Operating Temperature: 155°C; Package Quantity: 10; Resistance: 390R; Tolerance: 1%; Packaging: Cut Tape; Resistor Type: Thick Film; Number of Terminations: 2; Termination: SMD/SMT; Max Power Dissipation: 500mW; Temperature Coefficient: 100ppm/°C; Voltage Rating (DC): 200V; Features: Automotive AEC-Q200; Series: CRCW-HP; Resistance Tolerance: 1%; Technology: THICK FILM; Length: 0.122inch; Width: 0.063inch; Height: 0.026inch; Depth: 1.6mm; Lead Free: Lead Free; RoHS Compliant: Yes; Reach SVHC Compliant: Unknown; ComponentLink1URL: https://datasheet.ciiva.com/6546/crcwhpe3-6546213.pdf?src-supplier=Digikey; ComponentLink1Description: https://datasheet.ciiva.com/6546/crcwhpe3-6546213.pdf?src-supplier=Digikey; ComponentLink2URL: https://datasheet.ciiva.com/48524/crcwhpe3-48524826.pdf?src-supplier=Avnet; ComponentLink2Description: https://datasheet.ciiva.com/48524/crcwhpe3-48524826.pdf?src-supplier=Avnet; ComponentLink3URL: https://datasheet.ciiva.com/7673/1885357-7673082.pdf?src-supplier=Element14; ComponentLink3Description: https://datasheet.ciiva.com/7673/1885357-7673082.pdf?src-supplier=Element14; ComponentLink4URL: https://datasheet.ciiva.com/7673/1885357-7673081.pdf?src-supplier=Element14; ComponentLink4Description: https://datasheet.ciiva.com/7673/1885357-7673081.pdf?src-supplier=Element14; Supplier Part Number 1: 71-CRCW1206390RFKEAH
R4 = YC164-JR-0733RL: Res Thick Film Array 33 Ohm 5% 200ppm/ C ISOL Molded 8-Pin 1206(4 X 0603) Convex SMD Paper T/R; Manufacturer: Yageo; Number of Contacts: 8; Number of Circuits: 4; Voltage Rating: 50V; Circuit Type: Isolated; Power Per Element: 62.5mW; Temperature Coefficient: 200ppm/°C; Supplier 1: Future Electronics; Manufacturer Part Number: YC164-JR-0733RL; RoHS: Yes; Category: Resistor Arrays; Stock 1: 105000; Pricing 1: 5000=0.0064, 15000=0.0062, 25000=0.0061, 50000=0.006, 100000=0.0058 (USD); Mounting Technology: Surface Mount; Case/Package: 0603; Pins: 8; Case Code (Metric): 3216; Case Code (Imperial): 1206; Min Operating Temperature: -55°C; Max Operating Temperature: 155°C; Value: 33R; Tolerance: 5%; Packaging: Cut Tape; Number of Elements: 4; Package Quantity: 1; Number of Resistors: 4; Power Dissipation: 62.5mW; Working Voltage: 50V; Series: YC164; Technology: THICK FILM; Resistance Tolerance: 5%; Length: 0.126inch; Width: 0.063inch; Height: 0.028inch; Lead Free: Lead Free; Reach SVHC Compliant: Unknown; RoHS Compliant: Yes; ComponentLink1URL: https://datasheet.ciiva.com/2688/pyu-yc-tc164-51-rohs-l-3-2688397.pdf?src-supplier=Digikey; ComponentLink1Description: https://datasheet.ciiva.com/2688/pyu-yc-tc164-51-rohs-l-3-2688397.pdf?src-supplier=Digikey; ComponentLink2URL: https://datasheet.ciiva.com/2688/pyu-yc-tc164-51-rohs-l-3-2688398.pdf?src-supplier=Digikey; ComponentLink2Description: https://datasheet.ciiva.com/2688/pyu-yc-tc164-51-rohs-l-3-2688398.pdf?src-supplier=Digikey; ComponentLink3URL: https://datasheet.ciiva.com/2688/pyu-yc-tc164-51-rohs-l-3-2688399.pdf?src-supplier=Digikey; ComponentLink3Description: https://datasheet.ciiva.com/2688/pyu-yc-tc164-51-rohs-l-3-2688399.pdf?src-supplier=Digikey; ComponentLink4URL: https://datasheet.ciiva.com/8320/pyu-yc-tc164-51-rohs-l-3-8320237.pdf?src-supplier=Avnet; ComponentLink4Description: https://datasheet.ciiva.com/8320/pyu-yc-tc164-51-rohs-l-3-8320237.pdf?src-supplier=Avnet; ComponentLink5URL: https://datasheet.ciiva.com/8018/443424-8018013.pdf?src-supplier=Element14; ComponentLink5Description: https://datasheet.ciiva.com/8018/443424-8018013.pdf?src-supplier=Element14; ComponentLink6URL: https://datasheet.ciiva.com/8018/443424-8018014.pdf?src-supplier=Element14; ComponentLink6Description: https://datasheet.ciiva.com/8018/443424-8018014.pdf?src-supplier=Element14; Supplier Part Number 1: 1128537; Resistance: 33R
R5 = RC0402FR-07115KL: 62.5mW Thick Film Resistors 50V ±100ppm/℃ ±1% 115kΩ 0402 Chip Resistor - Surface Mount ROHS; Manufacturer: Yageo Group; Max Power Dissipation: 63mW; Temperature Coefficient: 100ppm/°C; Resistance: 115kR; Supplier 1: Avnet; Manufacturer Part Number: RC0402FR-07115KL; RoHS: Compliant; Category: Chip SMD Resistors; Stock 1: 4067; Pricing 1: 1=0.104, 25=0.009, 100=0.005, 500=0.004 (USD); Case/Package: 0402; Case Code (Imperial): 0402; Case Code (Metric): 1005; China RoHS: Non-Compliant; Composition: Thick Film; Contact Plating: Tin; Depth: 500µm; Features: Moisture Resistant; Height: 350µm; Lead Free: Lead Free; Length: 1mm; Lifecycle Status: Production; Max Operating Temperature: 155°C; Military Standard: Not; Min Operating Temperature: -55°C; Mounting Technology: Surface Mount; Number of Terminals: 2; Number of Terminations: 2; Power Dissipation: 62.5mW; Power Rating: 63mW; REACH SVHC: Yes; Value: 115kΩ; Schedule B: 8533210045, 8533210045|8533210045|8533210045|8533210045|8533210045; Termination: SMD/SMT; Tolerance: 1%; Voltage Rating: 50V; Voltage Rating (DC): 50V; Width: 500µm; Working Voltage: 50V; ComponentLink1URL: https://datasheet.octopart.com:443/RC0402FR-07115KL-Yageo-datasheet-175887523.pdf?src-supplier=Newark; ComponentLink1Description: https://datasheet.octopart.com:443/RC0402FR-07115KL-Yageo-datasheet-175887523.pdf?src-supplier=Newark; ComponentLink2URL: https://datasheet.octopart.com:443/RC0402FR-07115KL-Yageo-datasheet-103092701.pdf?src-supplier=Upverter; ComponentLink2Description: https://datasheet.octopart.com:443/RC0402FR-07115KL-Yageo-datasheet-103092701.pdf?src-supplier=Upverter; ComponentLink3URL: https://datasheet.octopart.com:443/RC0402FR-07115KL-Yageo-datasheet-10408619.pdf?src-supplier=_legacy+Avnet; ComponentLink3Description: https://datasheet.octopart.com:443/RC0402FR-07115KL-Yageo-datasheet-10408619.pdf?src-supplier=_legacy+Avnet; ComponentLink4URL: https://datasheet.octopart.com:443/RC0402FR-07115KL-Yageo-datasheet-164759695.pdf?src-supplier=Future+Electronics; ComponentLink4Description: https://datasheet.octopart.com:443/RC0402FR-07115KL-Yageo-datasheet-164759695.pdf?src-supplier=Future+Electronics; ComponentLink5URL: https://datasheet.octopart.com:443/RC0402FR-07115KL-Yageo-datasheet-137700087.pdf?src-supplier=Future+Electronics; ComponentLink5Description: https://datasheet.octopart.com:443/RC0402FR-07115KL-Yageo-datasheet-137700087.pdf?src-supplier=Future+Electronics; ComponentLink6URL: https://datasheet.octopart.com:443/RC0402FR-07115KL-Yageo-datasheet-12531192.pdf?src-supplier=Future+Electronics; ComponentLink6Description: https://datasheet.octopart.com:443/RC0402FR-07115KL-Yageo-datasheet-12531192.pdf?src-supplier=Future+Electronics; ComponentLink7URL: https://datasheet.octopart.com/RC0402FR-07115KL-Yageo-datasheet-73766026.pdf; ComponentLink7Description: https://datasheet.octopart.com/RC0402FR-07115KL-Yageo-datasheet-73766026.pdf; ComponentLink8URL: http://sigma.octopart.com:80/rohs_statement/Yageo-company-2.pdf?src-supplier=Compliance+Statements; ComponentLink8Description: http://sigma.octopart.com:80/rohs_statement/Yageo-company-2.pdf?src-supplier=Compliance+Statements; ComponentLink9URL: http://sigma.octopart.com:80/conflict_mineral_statement/Yageo-company-3.pdf?src-supplier=Compliance+Statements; ComponentLink9Description: http://sigma.octopart.com:80/conflict_mineral_statement/Yageo-company-3.pdf?src-supplier=Compliance+Statements; Supplier Part Number 1: 49AK1243
SB1 SB2 = SOLDERBRIDGE: Artikkelnr Noca: N.A.; Part Number: Solderbridge; Manufacturer: *; Manufacturer Part Number: *; Datasheet: *; LatestRevisionDate: 2009-12-14; Pin Count: 2; Publisher: Nordic Semiconductor; Published: 2009-12-14; Value: Solderbridge; Note: *; Supplier: *; Supplier part number: *; 2nd source Supplier: *; 2nd source part number: *; Footprint Doc: Solderbridge; Artikkelnr Simpro: N.A.
SB3 = SOLDERBRIDGE_SHORTED: Shorted Solderbridge; Part Number: Solderbridge Shorted; Artikkelnr Noca: N.A.; Manufacturer: *; Manufacturer Part Number: *; Datasheet: *; LatestRevisionDate: 2012-08-07; Pin Count: 2; Publisher: Nordic Semiconductor; Published: 2012-08-07; Value: Solderbridge; Note: *; Supplier: *; Supplier part number: *; 2nd source Supplier: *; 2nd source part number: *; Footprint Doc: Solderbridge_Shorted; Artikkelnr Simpro: N.A.
SW1 = B3U-1100P: SWITCH TACTILE SPST-NO 0.05A 12V; Manufacturer: Omron Electronics Inc-EMC Div; Switch Function: Off-Mom; Operating Force: 1.5N; Mechanical Life: 200000Cycles; Max Current Rating: 50mA; Illumination Type: Non-Illuminated; Actuator Type: Standard; Throw Configuration: SPST; Switch Travel: 0.15mm; Contact Resistance: 100mR; Actuator Length: 0.4mm; Ratings: Dust Proof; Termination: SMD/SMT; Packaging: Tape and Reel; Contact Plating: Silver; Max Operating Temperature: 70°C; Current Rating: 50mA; Electrical Life: 200000Cycles; Voltage Rating (DC): 12V; Length: 3.15mm; Weight: 0.022g; Min Operating Temperature: -25°C; Orientation: Straight; Contact Current Rating: 50mA; Package Quantity: 1; Max Voltage Rating (DC): 12V; Depth: 4mm; Lead Free: Lead Free; Mount: Surface Mount; Manufacturer Part Number: B3U-1100P
U1 = ESDR0502NMUTBG: Ultra Low Capacitance ESD Protection Array for High Speed Data Line Protection, 6-Pin UDFN, Pb-Free, Tape and Reel; Manufacturer: On Semiconductor; PPK Max (W): 100; C Max (pF): 0.6; V(BR) Min (V): 6; Direction: Unidirectional; IR Max (uA): 1; Number of Lines: 4; VRWM Max (V): 5.5; ComponentLink3Description: Package Specification; PartNumber: ESDR0502NMUTBG; PackageVersion: Rev. D, 09/2010; ComponentLink1URL: http://www.onsemi.com/; ComponentLink1Description: Manufacturer URL; DatasheetVersion: Rev. 4; Packing: Tape and Reel; PackageDescription: 6-Pin Small Outline No-Lead, Body 1.2 x 1 mm, Pitch 0.4 mm; RoHS: Pb-Free; ComponentLink3URL: http://www.onsemi.com/pub_link/Collateral/517AA.PDF; Mounting Technology: Surface Mount; PackageReference: UDFN-6-517AA-01; ComponentLink2Description: Datasheet; ComponentLink2URL: http://www.onsemi.cn/pub_link/Collateral/ESDR0502N-D.PDF; Manufacturer Part Number: ESDR0502NMUTBG
U2 = TPS7A2030PDBVR: 300-mA, ultra-low-noise, low-IQ, low-dropout (LDO) linear regulator with high PSRR 5-SOT-23 -40 to 125; Manufacturer: Texas Instruments; Supplier 1: Mouser; Manufacturer Part Number: TPS7A2030PDBVR; RoHS: Yes; Category: Voltage Regulators - Linear; Stock 1: 22538; Pricing 1: 1=0.49000, 10=0.41800, 50=0.41800, 100=0.29000, 1000=0.19000, 10000=0.15200 (USD); RoHS Compliant: Yes; Supplier Part Number 1: 595-TPS7A2030PDBVR
U3 = ATSAMD21G18A-MU: MCU 32-Bit SAM D21 ARM Cortex M0+ RISC 256KB Flash 3.3V 48-Pin QFN EP - Trays; Manufacturer: Microchip; Manufacturer Lifecycle Status: REL; Interface: I2C; Oscillator Type: Internal; Peripherals: Brown-out Detect/Reset; Number of I/Os: 38; Frequency: 48MHz; Data Bus Width: 32b; Max Junction Temperature (Tj): 100°C; Max Supply Voltage: 3.63V; Min Supply Voltage: 1.62V; Number of A/D Converters: 1; Number of ADC Channels: 14; Number of I2C Channels: 6; Number of PWM Channels: 20; Number of Timers/Counters: 8; RAM Size: 32kB; Watchdog Timer: Yes; Max Operating Temperature: 85°C; Core Architecture: ARM; Memory Size: 256KB; Memory Type: FLASH; Case/Package: QFN; Packaging: Tray; Min Operating Temperature: -40°C; Supplier: Newark; Supplier Part Number: ATSAMD21G18A-MU; Manufacturer Part Number: ATSAMD21G18A-MU; RoHS: Compliant; Category: Microcontrollers; Stock: 403; Pricing: 1=4.19, 10=4.01, 25=3.81, 50=3.64, 100=3.45 (USD); Projected EOL Date: 2039-11-29; Ambient Temperature Range High: 85°C; Contact Plating: Tin; Country of Assembly: Philippines, Taiwan, Thailand; Country of Fabrication: Taiwan; Country of Origin: Philippines, Taiwan, Thailand; Export Control Classification Number (ECCN) Code: 3A991.a.2; Height: 900µm; HS Code: 8542.31.0025; Harmonized Tariff Schedule (HTS) Code: 8542.31.0025; Lifecycle Status: Production; Clock Frequency: 48MHz; Memory Format: FLASH; Mounting Technology: Surface Mount; Pins: 48; Number of Programmable I/O: 38; Number of SPI Channels: 6; Number of UART Channels: 6; Number of USB Channels: 1; Operating Supply Voltage: 3.3V; REACH SVHC: No; Schedule B: 8542310000, 8542310000|8542310000|8542310000|8542310000|8542310000; ComponentLink1URL: https://datasheet.octopart.com:443/ATSAMD21G18A-MU-Microchip-datasheet-141002421.pdf?src-supplier=Geoflip; ComponentLink1Description: https://datasheet.octopart.com:443/ATSAMD21G18A-MU-Microchip-datasheet-141002421.pdf?src-supplier=Geoflip; ComponentLink2URL: https://sigma.octopart.com:443/141002422/technical_drawing/Microchip-ATSAMD21G18A-MU.pdf?src-supplier=Upverter; ComponentLink2Description: https://sigma.octopart.com:443/141002422/technical_drawing/Microchip-ATSAMD21G18A-MU.pdf?src-supplier=Upverter; ComponentLink3URL: https://datasheet.octopart.com:443/ATSAMD21G18A-MU-Atmel-datasheet-48569826.pdf?src-supplier=Upverter; ComponentLink3Description: https://datasheet.octopart.com:443/ATSAMD21G18A-MU-Atmel-datasheet-48569826.pdf?src-supplier=Upverter; ComponentLink4URL: https://datasheet.octopart.com:443/ATSAMD21G18A-MU-Microchip-datasheet-189045283.pdf?src-supplier=Microchip; ComponentLink4Description: https://datasheet.octopart.com:443/ATSAMD21G18A-MU-Microchip-datasheet-189045283.pdf?src-supplier=Microchip; ComponentLink5URL: https://datasheet.octopart.com:443/ATSAMD21G18A-MU-Microchip-datasheet-156012854.pdf?src-supplier=Microchip; ComponentLink5Description: https://datasheet.octopart.com:443/ATSAMD21G18A-MU-Microchip-datasheet-156012854.pdf?src-supplier=Microchip; ComponentLink6URL: https://datasheet.octopart.com:443/ATSAMD21G18A-MU-Microchip-datasheet-62316227.pdf?src-supplier=element14+APAC; ComponentLink6Description: https://datasheet.octopart.com:443/ATSAMD21G18A-MU-Microchip-datasheet-62316227.pdf?src-supplier=element14+APAC; ComponentLink7URL: https://datasheet.octopart.com:443/ATSAMD21G18A-MU-Atmel-datasheet-24968745.pdf?src-supplier=Farnell; ComponentLink7Description: https://datasheet.octopart.com:443/ATSAMD21G18A-MU-Atmel-datasheet-24968745.pdf?src-supplier=Farnell; ComponentLink8URL: https://datasheet.octopart.com:443/ATSAMD21G18A-MU-Microchip-datasheet-68295849.pdf?src-supplier=Electro+Sonic; ComponentLink8Description: https://datasheet.octopart.com:443/ATSAMD21G18A-MU-Microchip-datasheet-68295849.pdf?src-supplier=Electro+Sonic; ComponentLink9URL: https://datasheet.octopart.com:443/ATSAMD21G18A-MU-Microchip-datasheet-149521954.pdf?src-supplier=Microchip+SCT; ComponentLink9Description: https://datasheet.octopart.com:443/ATSAMD21G18A-MU-Microchip-datasheet-149521954.pdf?src-supplier=Microchip+SCT; ComponentLink10URL: https://datasheet.octopart.com:443/ATSAMD21G18A-MU-Microchip-datasheet-117009984.pdf?src-supplier=Future+Electronics; ComponentLink10Description: https://datasheet.octopart.com:443/ATSAMD21G18A-MU-Microchip-datasheet-117009984.pdf?src-supplier=Future+Electronics; ComponentLink11URL: https://datasheet.octopart.com:443/ATSAMD21G18A-MU-Microchip-datasheet-104525177.pdf?src-supplier=Future+Electronics; ComponentLink11Description: https://datasheet.octopart.com:443/ATSAMD21G18A-MU-Microchip-datasheet-104525177.pdf?src-supplier=Future+Electronics; ComponentLink12URL: https://datasheet.octopart.com:443/ATSAMD21G18A-MU-Microchip-datasheet-76796291.pdf?src-supplier=Future+Electronics; ComponentLink12Description: https://datasheet.octopart.com:443/ATSAMD21G18A-MU-Microchip-datasheet-76796291.pdf?src-supplier=Future+Electronics; ComponentLink13URL: https://datasheet.octopart.com:443/ATSAMD21G18A-MU-Microchip-datasheet-82525385.pdf?src-supplier=SHENGYU+ELECTRONICS; ComponentLink13Description: https://datasheet.octopart.com:443/ATSAMD21G18A-MU-Microchip-datasheet-82525385.pdf?src-supplier=SHENGYU+ELECTRONICS; ComponentLink14URL: https://datasheet.octopart.com:443/ATSAMD21G18A-MU-Microchip-datasheet-81455526.pdf?src-supplier=TME; ComponentLink14Description: https://datasheet.octopart.com:443/ATSAMD21G18A-MU-Microchip-datasheet-81455526.pdf?src-supplier=TME; ComponentLink15URL: http://sigma.octopart.com:80/188450237/materials_sheet/Microchip-ATSAMD21G18A-MU.pdf?src-supplier=Compliance+Statements; ComponentLink15Description: http://sigma.octopart.com:80/188450237/materials_sheet/Microchip-ATSAMD21G18A-MU.pdf?src-supplier=Compliance+Statements; ComponentLink16URL: http://sigma.octopart.com:80/rohs_statement/Microchip-company-71.pdf?src-supplier=Compliance+Statements; ComponentLink16Description: http://sigma.octopart.com:80/rohs_statement/Microchip-company-71.pdf?src-supplier=Compliance+Statements; ComponentLink17URL: http://sigma.octopart.com:80/reach_statement/Microchip-company-70.pdf?src-supplier=Compliance+Statements; ComponentLink17Description: http://sigma.octopart.com:80/reach_statement/Microchip-company-70.pdf?src-supplier=Compliance+Statements; ComponentLink18URL: http://sigma.octopart.com:80/conflict_mineral_statement/Microchip-company-69.pdf?src-supplier=Compliance+Statements; ComponentLink18Description: http://sigma.octopart.com:80/conflict_mineral_statement/Microchip-company-69.pdf?src-supplier=Compliance+Statements; ComponentLink19URL: http://sigma.octopart.com:80/conflict_mineral_statement/Microchip-company-68.pdf?src-supplier=Compliance+Statements; ComponentLink19Description: http://sigma.octopart.com:80/conflict_mineral_statement/Microchip-company-68.pdf?src-supplier=Compliance+Statements; ComponentLink20URL: http://sigma.octopart.com:80/reach_statement/Atmel-company-6.pdf?src-supplier=Compliance+Statements; ComponentLink20Description: http://sigma.octopart.com:80/reach_statement/Atmel-company-6.pdf?src-supplier=Compliance+Statements; ComponentLink21URL: http://sigma.octopart.com:80/rohs_statement/Atmel-company-5.pdf?src-supplier=Compliance+Statements; ComponentLink21Description: http://sigma.octopart.com:80/rohs_statement/Atmel-company-5.pdf?src-supplier=Compliance+Statements; ComponentLink22URL: http://sigma.octopart.com:80/rohs_statement/Atmel-company-4.pdf?src-supplier=Compliance+Statements; ComponentLink22Description: http://sigma.octopart.com:80/rohs_statement/Atmel-company-4.pdf?src-supplier=Compliance+Statements

## Assembly variants
Main: not fitted P1 P2 P3 P4 R5